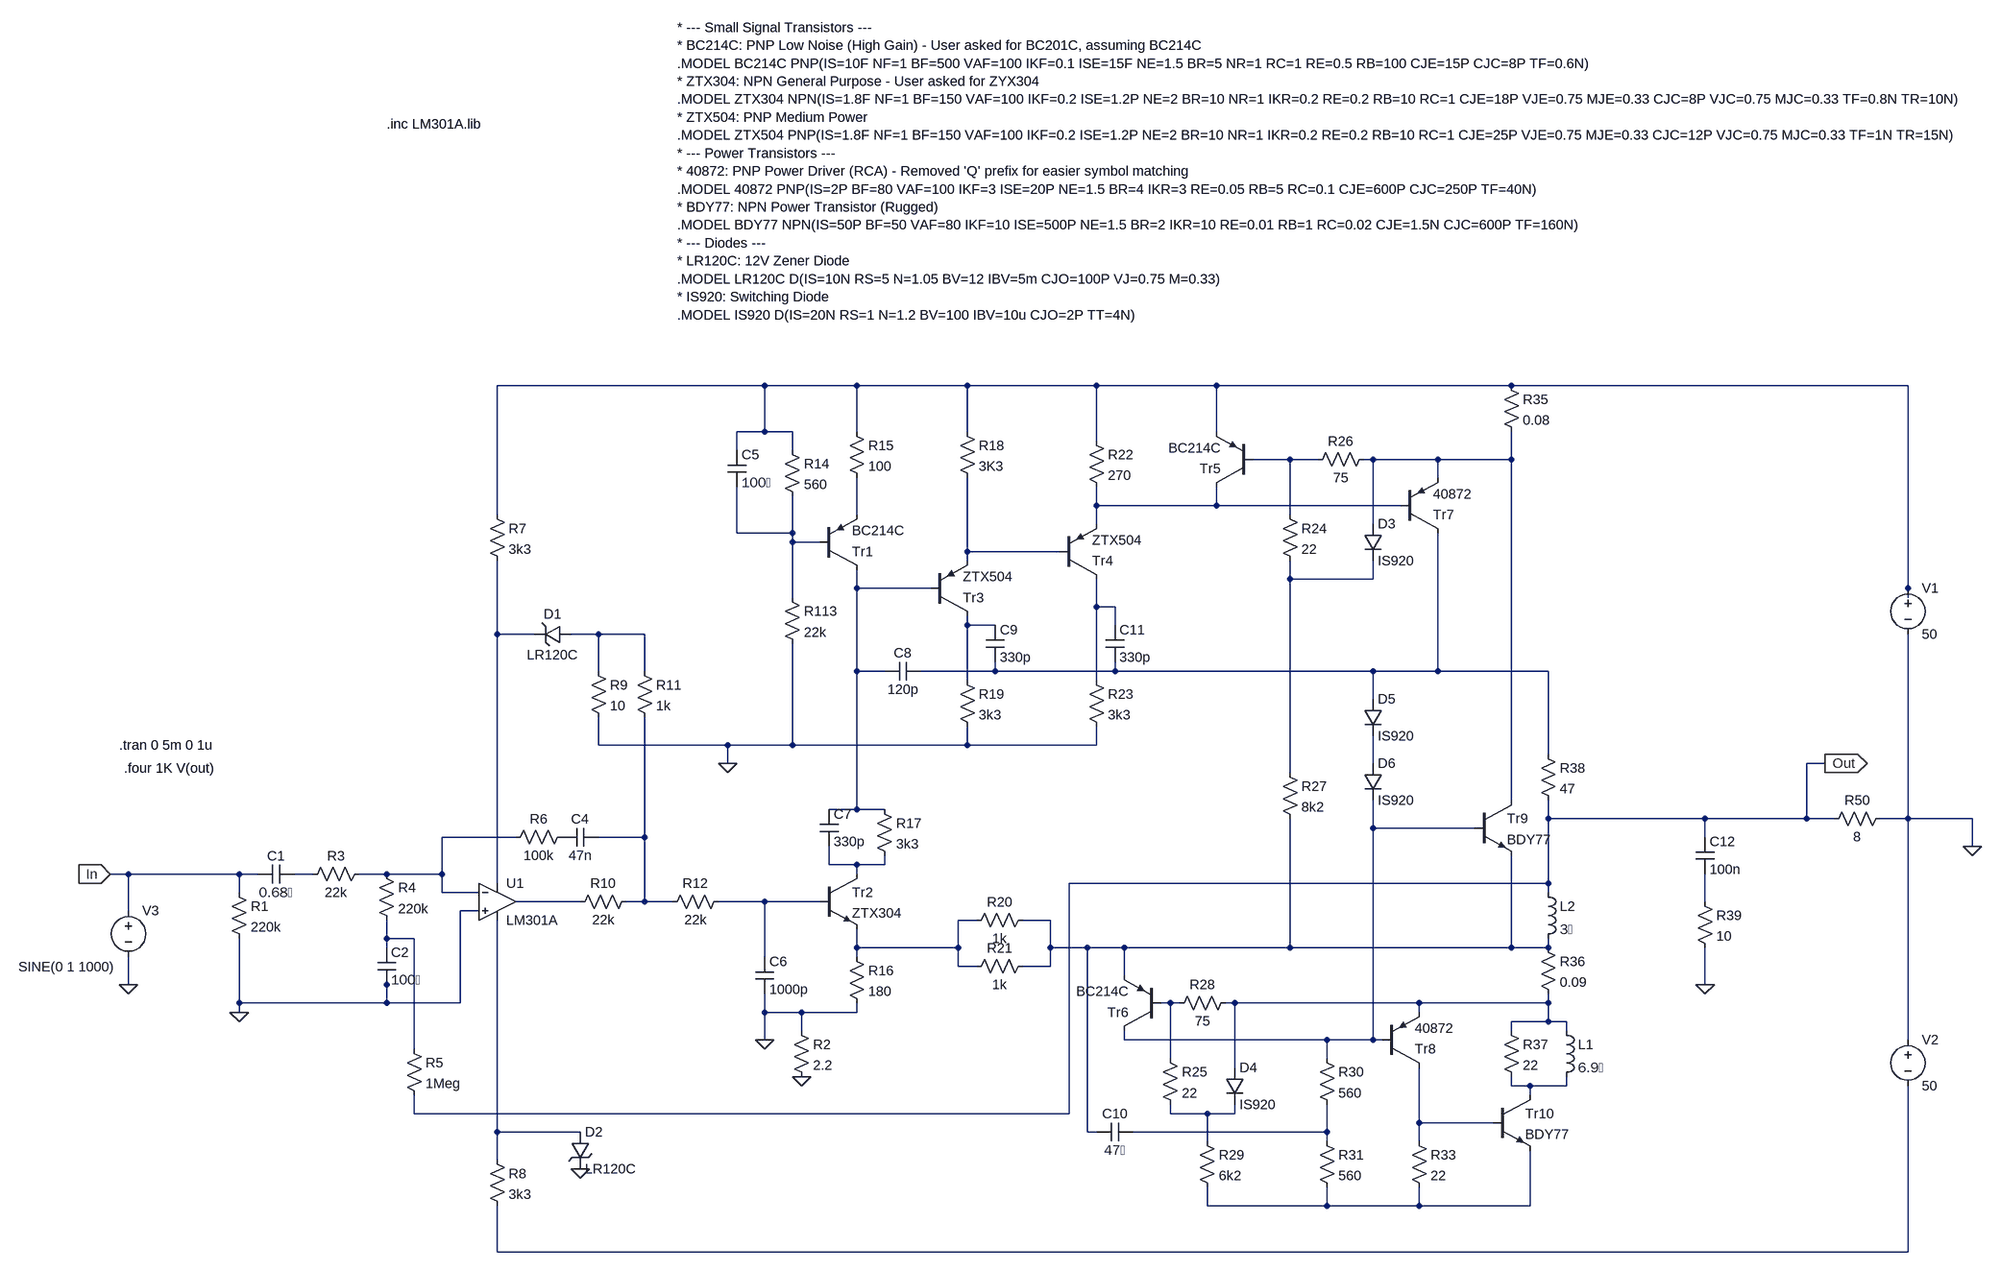
[diagram p0: schematic Quad405.asc]
Quad405.asc, the LTspice schematic file:
Version 4.1
SHEET 1 2632 1080
WIRE 224 -432 -240 -432
WIRE 384 -432 224 -432
WIRE 576 -432 384 -432
WIRE 800 -432 576 -432
WIRE 1008 -432 800 -432
WIRE 1520 -432 1008 -432
WIRE 2208 -432 1520 -432
WIRE 224 -352 224 -432
WIRE 224 -352 176 -352
WIRE 272 -352 224 -352
WIRE 384 -352 384 -432
WIRE 576 -352 576 -432
WIRE 1008 -352 1008 -432
WIRE 800 -336 800 -432
WIRE 176 -320 176 -352
WIRE 272 -320 272 -352
WIRE 1136 -304 1072 -304
WIRE 1184 -304 1136 -304
WIRE 1280 -304 1264 -304
WIRE 1392 -304 1280 -304
WIRE 1520 -304 1520 -352
WIRE 1520 -304 1392 -304
WIRE 1392 -272 1392 -304
WIRE 800 -224 800 -256
WIRE 1008 -224 1008 -256
WIRE 1008 -224 800 -224
WIRE 1328 -224 1008 -224
WIRE -240 -208 -240 -432
WIRE 384 -208 384 -272
WIRE 1136 -208 1136 -304
WIRE 800 -192 800 -224
WIRE 1280 -192 1280 -304
WIRE 176 -176 176 -256
WIRE 272 -176 272 -240
WIRE 272 -176 176 -176
WIRE 272 -160 272 -176
WIRE 320 -160 272 -160
WIRE 576 -144 576 -272
WIRE 736 -144 576 -144
WIRE 576 -128 576 -144
WIRE 1136 -96 1136 -128
WIRE 1280 -96 1280 -128
WIRE 1280 -96 1136 -96
WIRE 384 -80 384 -112
WIRE 512 -80 384 -80
WIRE 2208 -80 2208 -432
WIRE 272 -64 272 -160
WIRE 2208 -64 2208 -80
WIRE 800 -48 800 -96
WIRE 832 -48 800 -48
WIRE 576 -16 576 -32
WIRE 624 -16 576 -16
WIRE 832 -16 832 -48
WIRE -240 0 -240 -128
WIRE -176 0 -240 0
WIRE -64 0 -112 0
WIRE 16 0 -64 0
WIRE -64 64 -64 0
WIRE 16 64 16 0
WIRE 384 64 384 -80
WIRE 432 64 384 64
WIRE 624 64 624 48
WIRE 624 64 496 64
WIRE 832 64 832 48
WIRE 832 64 624 64
WIRE 1280 64 832 64
WIRE 1392 64 1392 -176
WIRE 1392 64 1280 64
WIRE 1584 64 1392 64
WIRE 576 80 576 -16
WIRE 800 80 800 -48
WIRE 1280 112 1280 64
WIRE -64 192 -64 144
WIRE 160 192 -64 192
WIRE 272 192 272 16
WIRE 272 192 160 192
WIRE 576 192 576 160
WIRE 576 192 272 192
WIRE 800 192 800 160
WIRE 800 192 576 192
WIRE 1584 208 1584 64
WIRE 160 224 160 192
WIRE 1280 224 1280 176
WIRE 2064 224 2032 224
WIRE 1136 240 1136 -96
WIRE 1520 288 1520 -304
WIRE 384 304 384 64
WIRE 384 304 336 304
WIRE 432 304 384 304
WIRE 1584 320 1584 288
WIRE 1856 320 1584 320
WIRE 2032 320 2032 224
WIRE 2032 320 1856 320
WIRE 2080 320 2032 320
WIRE 2208 320 2208 0
WIRE 2208 320 2160 320
WIRE 2320 320 2208 320
WIRE 1280 336 1280 288
WIRE 1456 336 1280 336
WIRE -208 352 -336 352
WIRE 16 352 16 144
WIRE 16 352 -64 352
WIRE 1856 352 1856 320
WIRE 2320 368 2320 320
WIRE 336 400 336 368
WIRE 384 400 336 400
WIRE 432 400 432 384
WIRE 432 400 384 400
WIRE -880 416 -912 416
WIRE -688 416 -880 416
WIRE -656 416 -688 416
WIRE -560 416 -592 416
WIRE -432 416 -480 416
WIRE -336 416 -336 352
WIRE -336 416 -432 416
WIRE 384 416 384 400
WIRE -240 432 -240 0
WIRE 1584 432 1584 320
WIRE 1584 432 752 432
WIRE -688 448 -688 416
WIRE -336 448 -336 416
WIRE -272 448 -336 448
WIRE 1584 448 1584 432
WIRE -96 464 -208 464
WIRE 16 464 16 352
WIRE 16 464 -16 464
WIRE 64 464 16 464
WIRE 224 464 144 464
WIRE 320 464 224 464
WIRE 1856 464 1856 416
WIRE -880 480 -880 416
WIRE -272 480 -304 480
WIRE 592 496 560 496
WIRE 720 496 672 496
WIRE -432 528 -432 496
WIRE -384 528 -432 528
WIRE -432 544 -432 528
WIRE 384 544 384 512
WIRE 560 544 560 496
WIRE 560 544 384 544
WIRE 720 544 720 496
WIRE 784 544 720 544
WIRE 848 544 784 544
WIRE 1136 544 1136 320
WIRE 1136 544 848 544
WIRE 1520 544 1520 384
WIRE 1520 544 1136 544
WIRE 1584 544 1584 528
WIRE 1584 544 1520 544
WIRE 224 560 224 464
WIRE 384 560 384 544
WIRE 560 576 560 544
WIRE 592 576 560 576
WIRE 720 576 720 544
WIRE 720 576 672 576
WIRE 848 592 848 544
WIRE -880 608 -880 560
WIRE -432 608 -432 592
WIRE 1856 608 1856 544
WIRE -688 640 -688 528
WIRE -432 640 -432 608
WIRE -432 640 -688 640
WIRE -304 640 -304 480
WIRE -304 640 -432 640
WIRE 928 640 912 640
WIRE 944 640 928 640
WIRE 1040 640 1024 640
WIRE 1360 640 1040 640
WIRE 1584 640 1584 624
WIRE 1584 640 1360 640
WIRE -688 656 -688 640
WIRE 224 656 224 624
WIRE 288 656 224 656
WIRE 384 656 384 640
WIRE 384 656 288 656
WIRE 1360 656 1360 640
WIRE 1584 672 1584 640
WIRE 1584 672 1520 672
WIRE 1616 672 1584 672
WIRE 288 688 288 656
WIRE 1520 688 1520 672
WIRE 1616 688 1616 672
WIRE 224 704 224 656
WIRE 848 704 848 688
WIRE 1200 704 848 704
WIRE 1280 704 1280 336
WIRE 1280 704 1200 704
WIRE 1296 704 1280 704
WIRE 2208 704 2208 320
WIRE -384 720 -384 528
WIRE 928 736 928 640
WIRE 1200 736 1200 704
WIRE 1040 752 1040 640
WIRE 1520 784 1520 768
WIRE 1552 784 1520 784
WIRE 1616 784 1616 768
WIRE 1616 784 1552 784
WIRE 1552 800 1552 784
WIRE -384 832 -384 800
WIRE 752 832 752 432
WIRE 752 832 -384 832
WIRE 928 832 928 816
WIRE 992 832 928 832
WIRE 1040 832 1040 816
WIRE 1040 832 992 832
WIRE 1360 848 1360 752
WIRE 1488 848 1360 848
WIRE -240 864 -240 496
WIRE -96 864 -240 864
WIRE 784 864 784 544
WIRE 800 864 784 864
WIRE 1200 864 1200 816
WIRE 1200 864 864 864
WIRE 992 880 992 832
WIRE 1200 880 1200 864
WIRE 1360 880 1360 848
WIRE -240 912 -240 864
WIRE 992 992 992 960
WIRE 1200 992 1200 960
WIRE 1200 992 992 992
WIRE 1360 992 1360 960
WIRE 1360 992 1200 992
WIRE 1552 992 1552 896
WIRE 1552 992 1360 992
WIRE -240 1072 -240 992
WIRE 2208 1072 2208 784
WIRE 2208 1072 -240 1072
FLAG 2320 368 0
FLAG -688 656 0
FLAG -880 608 0
FLAG 2064 224 Out
IOPIN 2064 224 Out
FLAG -912 416 In
IOPIN -912 416 In
FLAG 288 768 0
FLAG 224 704 0
FLAG 160 224 0
FLAG 1856 608 0
FLAG -96 928 0
DATAFLAG -240 592 ""
DATAFLAG 2208 -256 ""
DATAFLAG 2208 880 ""
DATAFLAG 688 -432 ""
DATAFLAG 32 -432 ""
DATAFLAG -240 160 ""
DATAFLAG -128 464 ""
SYMBOL res -704 432 R0
SYMATTR InstName R1
SYMATTR Value 220k
SYMBOL res -464 400 R90
WINDOW 0 0 56 VBottom 2
WINDOW 3 32 56 VTop 2
SYMATTR InstName R3
SYMATTR Value 22k
SYMBOL res 2176 304 R90
WINDOW 0 0 56 VBottom 2
WINDOW 3 32 56 VTop 2
SYMATTR InstName R50
SYMATTR Value 8
SYMBOL voltage 2208 -96 R0
SYMATTR InstName V1
SYMATTR Value 50
SYMBOL voltage 2208 688 R0
SYMATTR InstName V2
SYMATTR Value 50
SYMBOL voltage -880 464 R0
WINDOW 123 24 124 Left 2
WINDOW 39 0 0 Left 0
WINDOW 3 -191 113 Left 2
SYMATTR Value SINE(0 1 1000)
SYMATTR InstName V3
SYMBOL pnp 512 -32 M180
SYMATTR InstName Tr3
SYMATTR Value ZTX504
SYMBOL npn 320 416 R0
SYMATTR InstName Tr2
SYMATTR Value ZTX304
SYMBOL cap -64 336 R90
WINDOW 0 0 32 VBottom 2
WINDOW 3 32 32 VTop 2
SYMATTR InstName C4
SYMATTR Value 47n
SYMBOL cap -592 400 R90
WINDOW 0 0 32 VBottom 2
WINDOW 3 32 32 VTop 2
SYMATTR InstName C1
SYMATTR Value 0.68�
SYMBOL res -448 400 R0
SYMATTR InstName R4
SYMATTR Value 220k
SYMBOL cap -448 544 R0
SYMATTR InstName C2
SYMATTR Value 100�
SYMBOL res -112 336 R90
WINDOW 0 0 56 VBottom 2
WINDOW 3 32 56 VTop 2
SYMATTR InstName R6
SYMATTR Value 100k
SYMBOL res 0 448 R90
WINDOW 0 0 56 VBottom 2
WINDOW 3 32 56 VTop 2
SYMATTR InstName R10
SYMATTR Value 22k
SYMBOL res 160 448 R90
WINDOW 0 0 56 VBottom 2
WINDOW 3 32 56 VTop 2
SYMATTR InstName R12
SYMATTR Value 22k
SYMBOL res 0 48 R0
SYMATTR InstName R11
SYMATTR Value 1k
SYMBOL cap 160 -320 R0
SYMATTR InstName C5
SYMATTR Value 100�
SYMBOL res 256 -336 R0
SYMATTR InstName R14
SYMATTR Value 560
SYMBOL pnp 320 -112 M180
SYMATTR InstName Tr1
SYMATTR Value BC214C
SYMBOL res 368 -368 R0
SYMATTR InstName R15
SYMATTR Value 100
SYMBOL res 256 -80 R0
SYMATTR InstName R113
SYMATTR Value 22k
SYMBOL res 560 -368 R0
SYMATTR InstName R18
SYMATTR Value 3K3
SYMBOL pnp 736 -96 M180
SYMATTR InstName Tr4
SYMATTR Value ZTX504
SYMBOL pnp 1072 -256 R180
SYMATTR InstName Tr5
SYMATTR Value BC214C
SYMBOL res 784 -352 R0
SYMATTR InstName R22
SYMATTR Value 270
SYMBOL res 1120 -224 R0
SYMATTR InstName R24
SYMATTR Value 22
SYMBOL res 1280 -320 R90
WINDOW 0 0 56 VBottom 2
WINDOW 3 32 56 VTop 2
SYMATTR InstName R26
SYMATTR Value 75
SYMBOL res 1504 -448 R0
SYMATTR InstName R35
SYMATTR Value 0.08
SYMBOL pnp 1328 -176 M180
SYMATTR InstName Tr7
SYMATTR Value 40872
SYMBOL ind 1568 432 R0
SYMATTR InstName L2
SYMATTR Value 3�
SYMATTR SpiceLine Rser=1m
SYMBOL zener -112 -16 R90
WINDOW 0 -4 32 VBottom 2
WINDOW 3 36 32 VTop 2
SYMATTR InstName D1
SYMATTR Value LR120C
SYMBOL diode 1264 -192 R0
SYMATTR InstName D3
SYMATTR Value IS920
SYMBOL cap 608 -16 R0
SYMATTR InstName C9
SYMATTR Value 330p
SYMBOL cap 816 -16 R0
SYMATTR InstName C11
SYMATTR Value 330p
SYMBOL res 560 64 R0
SYMATTR InstName R19
SYMATTR Value 3k3
SYMBOL res 784 64 R0
SYMATTR InstName R23
SYMATTR Value 3k3
SYMBOL cap 496 48 R90
WINDOW 0 0 32 VBottom 2
WINDOW 3 32 32 VTop 2
SYMATTR InstName C8
SYMATTR Value 120p
SYMBOL cap 320 304 R0
SYMATTR InstName C7
SYMATTR Value 330p
SYMBOL res 416 288 R0
SYMATTR InstName R17
SYMATTR Value 3k3
SYMBOL cap 208 560 R0
SYMATTR InstName C6
SYMATTR Value 1000p
SYMBOL res 368 544 R0
SYMATTR InstName R16
SYMATTR Value 180
SYMBOL res 272 672 R0
SYMATTR InstName R2
SYMATTR Value 2.2
SYMBOL res 688 480 R90
WINDOW 0 0 56 VBottom 2
WINDOW 3 32 56 VTop 2
SYMATTR InstName R20
SYMATTR Value 1k
SYMBOL res 688 560 R90
WINDOW 0 0 56 VBottom 2
WINDOW 3 32 56 VTop 2
SYMATTR InstName R21
SYMATTR Value 1k
SYMBOL pnp 912 688 R180
SYMATTR InstName Tr6
SYMATTR Value BC214C
SYMBOL res 1040 624 R90
WINDOW 0 0 56 VBottom 2
WINDOW 3 32 56 VTop 2
SYMATTR InstName R28
SYMATTR Value 75
SYMBOL res 912 720 R0
SYMATTR InstName R25
SYMATTR Value 22
SYMBOL diode 1024 752 R0
SYMATTR InstName D4
SYMATTR Value IS920
SYMBOL cap 864 848 R90
WINDOW 0 0 32 VBottom 2
WINDOW 3 32 32 VTop 2
SYMATTR InstName C10
SYMATTR Value 47�
SYMBOL res 976 864 R0
SYMATTR InstName R29
SYMATTR Value 6k2
SYMBOL res 1184 720 R0
SYMATTR InstName R30
SYMATTR Value 560
SYMBOL res 1184 864 R0
SYMATTR InstName R31
SYMATTR Value 560
SYMBOL pnp 1296 752 M180
SYMATTR InstName Tr8
SYMATTR Value 40872
SYMBOL npn 1488 800 R0
SYMATTR InstName Tr10
SYMATTR Value BDY77
SYMBOL npn 1456 288 R0
SYMATTR InstName Tr9
SYMATTR Value BDY77
SYMBOL ind 1600 672 R0
SYMATTR InstName L1
SYMATTR Value 6.9�
SYMATTR SpiceLine Rser=1m
SYMBOL res 1504 672 R0
SYMATTR InstName R37
SYMATTR Value 22
SYMBOL res 1568 528 R0
SYMATTR InstName R36
SYMATTR Value 0.09
SYMBOL res 1568 192 R0
SYMATTR InstName R38
SYMATTR Value 47
SYMBOL diode 1264 112 R0
SYMATTR InstName D5
SYMATTR Value IS920
SYMBOL diode 1264 224 R0
SYMATTR InstName D6
SYMATTR Value IS920
SYMBOL res 1120 224 R0
SYMATTR InstName R27
SYMATTR Value 8k2
SYMBOL res 1344 864 R0
SYMATTR InstName R33
SYMATTR Value 22
SYMBOL cap 1840 352 R0
SYMATTR InstName C12
SYMATTR Value 100n
SYMBOL res 1840 448 R0
SYMATTR InstName R39
SYMATTR Value 10
SYMBOL res -256 896 R0
SYMATTR InstName R8
SYMATTR Value 3k3
SYMBOL zener -112 864 R0
SYMATTR InstName D2
SYMATTR Value LR120C
SYMBOL res -400 704 R0
SYMATTR InstName R5
SYMATTR Value 1Meg
SYMBOL OpAmps\\opamp2 -240 400 R0
SYMATTR InstName U1
SYMATTR Value LM301A
SYMBOL res -256 -224 R0
SYMATTR InstName R7
SYMATTR Value 3k3
SYMBOL res -80 48 R0
SYMATTR InstName R9
SYMATTR Value 10
TEXT -888 232 Left 2 !.four 1K V(out)
TEXT -896 192 Left 2 !.tran 0 5m 0 1u
TEXT 72 -1184 Left 2 !* --- Small Signal Transistors ---\n* BC214C: PNP Low Noise (High Gain) - User asked for BC201C, assuming BC214C\n.MODEL BC214C PNP(IS=10F NF=1 BF=500 VAF=100 IKF=0.1 ISE=15F NE=1.5 BR=5 NR=1 RC=1 RE=0.5 RB=100 CJE=15P CJC=8P TF=0.6N)\n* ZTX304: NPN General Purpose - User asked for ZYX304\n.MODEL ZTX304 NPN(IS=1.8F NF=1 BF=150 VAF=100 IKF=0.2 ISE=1.2P NE=2 BR=10 NR=1 IKR=0.2 RE=0.2 RB=10 RC=1 CJE=18P VJE=0.75 MJE=0.33 CJC=8P VJC=0.75 MJC=0.33 TF=0.8N TR=10N)\n* ZTX504: PNP Medium Power\n.MODEL ZTX504 PNP(IS=1.8F NF=1 BF=150 VAF=100 IKF=0.2 ISE=1.2P NE=2 BR=10 NR=1 IKR=0.2 RE=0.2 RB=10 RC=1 CJE=25P VJE=0.75 MJE=0.33 CJC=12P VJC=0.75 MJC=0.33 TF=1N TR=15N)\n* --- Power Transistors ---\n* 40872: PNP Power Driver (RCA) - Removed 'Q' prefix for easier symbol matching\n.MODEL 40872 PNP(IS=2P BF=80 VAF=100 IKF=3 ISE=20P NE=1.5 BR=4 IKR=3 RE=0.05 RB=5 RC=0.1 CJE=600P CJC=250P TF=40N)\n* BDY77: NPN Power Transistor (Rugged)\n.MODEL BDY77 NPN(IS=50P BF=50 VAF=80 IKF=10 ISE=500P NE=1.5 BR=2 IKR=10 RE=0.01 RB=1 RC=0.02 CJE=1.5N CJC=600P TF=160N)\n* --- Diodes ---\n* LR120C: 12V Zener Diode\n.MODEL LR120C D(IS=10N RS=5 N=1.05 BV=12 IBV=5m CJO=100P VJ=0.75 M=0.33)\n* IS920: Switching Diode\n.MODEL IS920 D(IS=20N RS=1 N=1.2 BV=100 IBV=10u CJO=2P TT=4N)
TEXT -432 -1016 Left 2 !.inc LM301A.lib

The netlist it stands for:
* Quad405.asc
R1 In 0 220k
R3 N017 N020 22k
R50 0 Out 8
V1 N001 0 50
V2 0 N035 50
V3 In 0 SINE(0 1 1000)
Q§Tr3 N011 N009 N007 0 ZTX504
Q§Tr2 N019 N022 N024 0 ZTX304
C4 N018 P001 47n
C1 N020 In 0.68�
R4 N017 N026 220k
C2 N026 0 100�
R6 P001 N017 100k
R10 N018 N021 22k
R12 N022 N018 22k
R11 N013 N018 1k
C5 N001 N006 100�
R14 N001 N006 560
Q§Tr1 N009 N006 N005 0 BC214C
R15 N001 N005 100
R113 N006 0 22k
R18 N001 N007 3K3
Q§Tr4 N010 N007 N004 0 ZTX504
Q§Tr5 N004 N002 N001 0 BC214C
R22 N001 N004 270
R24 N002 N008 22
R26 N003 N002 75
R35 N001 N003 0.08
Q§Tr7 N014 N004 N003 0 40872
L2 Out N025 3� Rser=1m
D1 N013 N012 LR120C
D3 N003 N008 IS920
C9 N011 N014 330p
C11 N010 N014 330p
R19 N011 0 3k3
R23 N010 0 3k3
C8 N014 N009 120p
C7 N009 N019 330p
R17 N009 N019 3k3
C6 N022 0 1000p
R16 N024 0 180
R2 0 0 2.2
R20 N025 N024 1k
R21 N025 N024 1k
Q§Tr6 N016 N027 N025 0 BC214C
R28 N028 N027 75
R25 N027 N030 22
D4 N028 N030 IS920
C10 N033 N025 47�
R29 N030 N034 6k2
R30 N016 N033 560
R31 N033 N034 560
Q§Tr8 N031 N016 N028 0 40872
Q§Tr10 N029 N031 N034 0 BDY77
Q§Tr9 N003 N016 N025 0 BDY77
L1 N028 N029 6.9� Rser=1m
R37 N028 N029 22
R36 N025 N028 0.09
R38 N014 Out 47
D5 N014 N015 IS920
D6 N015 N016 IS920
R27 N008 N025 8k2
R33 N031 N034 22
C12 Out N023 100n
R39 N023 0 10
R8 N032 N035 3k3
D2 N032 0 LR120C
R5 N026 Out 1Meg
X§U1 0 N017 N012 N032 N021 LM301A  ; pins In+ In- V+ V- OUT
R7 N001 N012 3k3
R9 N013 0 10
.model D D
.lib standard.dio
.model NPN NPN
.model PNP PNP
.lib standard.bjt
.four 1K V(out)
.tran 0 5m 0 1u
* --- Small Signal Transistors ---
* BC214C: PNP Low Noise (High Gain) - User asked for BC201C, assuming BC214C
.MODEL BC214C PNP(IS=10F NF=1 BF=500 VAF=100 IKF=0.1 ISE=15F NE=1.5 BR=5 NR=1 RC=1 RE=0.5 RB=100 CJE=15P CJC=8P TF=0.6N)
* ZTX304: NPN General Purpose - User asked for ZYX304
.MODEL ZTX304 NPN(IS=1.8F NF=1 BF=150 VAF=100 IKF=0.2 ISE=1.2P NE=2 BR=10 NR=1 IKR=0.2 RE=0.2 RB=10 RC=1 CJE=18P VJE=0.75 MJE=0.33 CJC=8P VJC=0.75 MJC=0.33 TF=0.8N TR=10N)
* ZTX504: PNP Medium Power
.MODEL ZTX504 PNP(IS=1.8F NF=1 BF=150 VAF=100 IKF=0.2 ISE=1.2P NE=2 BR=10 NR=1 IKR=0.2 RE=0.2 RB=10 RC=1 CJE=25P VJE=0.75 MJE=0.33 CJC=12P VJC=0.75 MJC=0.33 TF=1N TR=15N)
* --- Power Transistors ---
* 40872: PNP Power Driver (RCA) - Removed 'Q' prefix for easier symbol matching
.MODEL 40872 PNP(IS=2P BF=80 VAF=100 IKF=3 ISE=20P NE=1.5 BR=4 IKR=3 RE=0.05 RB=5 RC=0.1 CJE=600P CJC=250P TF=40N)
* BDY77: NPN Power Transistor (Rugged)
.MODEL BDY77 NPN(IS=50P BF=50 VAF=80 IKF=10 ISE=500P NE=1.5 BR=2 IKR=10 RE=0.01 RB=1 RC=0.02 CJE=1.5N CJC=600P TF=160N)
* --- Diodes ---
* LR120C: 12V Zener Diode
.MODEL LR120C D(IS=10N RS=5 N=1.05 BV=12 IBV=5m CJO=100P VJ=0.75 M=0.33)
* IS920: Switching Diode
.MODEL IS920 D(IS=20N RS=1 N=1.2 BV=100 IBV=10u CJO=2P TT=4N)
.inc LM301A.lib
.backanno
.end